# Altium schematic sheet RELAYS.SchDoc
size 420 x 297 mm
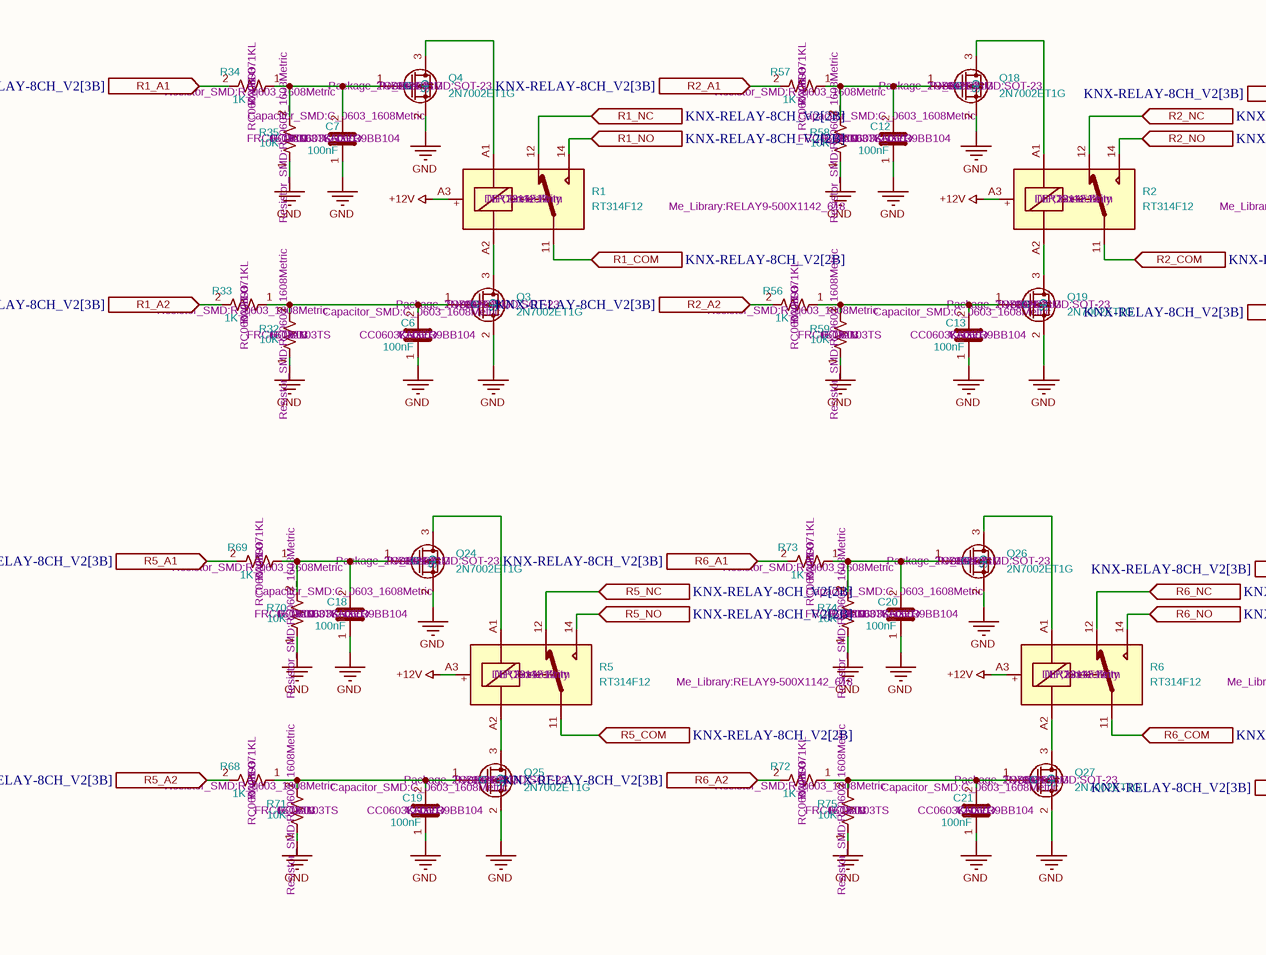
[diagram p0: RELAYS.SchDoc, left]
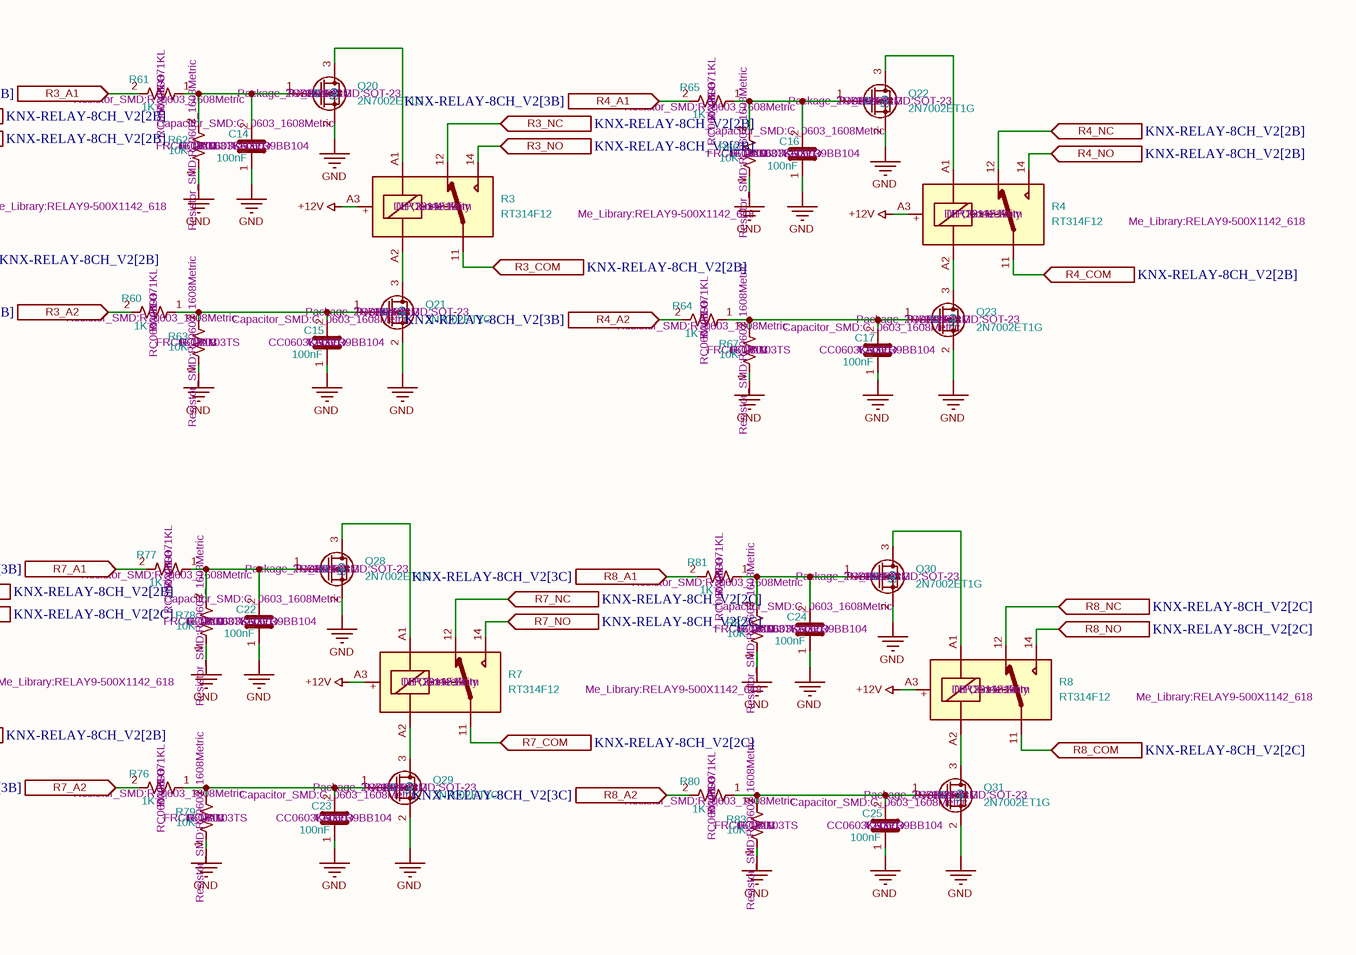
[diagram p1: RELAYS.SchDoc, right]

## Parts
C6  Manufacturer Part Number: CC0603KRX7R9BB104  Manufacturer: YAGEO  Package: C_0603  Footprint: Capacitor_SMD:C_0603_1608Metric  [C_0603_1608Metric]  (hidden comment: 100nF)
C7  Manufacturer Part Number: CC0603KRX7R9BB104  Manufacturer: YAGEO  Package: C_0603  Footprint: Capacitor_SMD:C_0603_1608Metric  [C_0603_1608Metric]  (hidden comment: 100nF)
C12  Manufacturer Part Number: CC0603KRX7R9BB104  Manufacturer: YAGEO  Package: C_0603  Footprint: Capacitor_SMD:C_0603_1608Metric  [C_0603_1608Metric]  (hidden comment: 100nF)
C13  Manufacturer Part Number: CC0603KRX7R9BB104  Manufacturer: YAGEO  Package: C_0603  Footprint: Capacitor_SMD:C_0603_1608Metric  [C_0603_1608Metric]  (hidden comment: 100nF)
C14  Manufacturer Part Number: CC0603KRX7R9BB104  Manufacturer: YAGEO  Package: C_0603  Footprint: Capacitor_SMD:C_0603_1608Metric  [C_0603_1608Metric]  (hidden comment: 100nF)
C15  Manufacturer Part Number: CC0603KRX7R9BB104  Manufacturer: YAGEO  Package: C_0603  Footprint: Capacitor_SMD:C_0603_1608Metric  [C_0603_1608Metric]  (hidden comment: 100nF)
C16  Manufacturer Part Number: CC0603KRX7R9BB104  Manufacturer: YAGEO  Package: C_0603  Footprint: Capacitor_SMD:C_0603_1608Metric  [C_0603_1608Metric]  (hidden comment: 100nF)
C17  Manufacturer Part Number: CC0603KRX7R9BB104  Manufacturer: YAGEO  Package: C_0603  Footprint: Capacitor_SMD:C_0603_1608Metric  [C_0603_1608Metric]  (hidden comment: 100nF)
C18  Manufacturer Part Number: CC0603KRX7R9BB104  Manufacturer: YAGEO  Package: C_0603  Footprint: Capacitor_SMD:C_0603_1608Metric  [C_0603_1608Metric]  (hidden comment: 100nF)
C19  Manufacturer Part Number: CC0603KRX7R9BB104  Manufacturer: YAGEO  Package: C_0603  Footprint: Capacitor_SMD:C_0603_1608Metric  [C_0603_1608Metric]  (hidden comment: 100nF)
C20  Manufacturer Part Number: CC0603KRX7R9BB104  Manufacturer: YAGEO  Package: C_0603  Footprint: Capacitor_SMD:C_0603_1608Metric  [C_0603_1608Metric]  (hidden comment: 100nF)
C21  Manufacturer Part Number: CC0603KRX7R9BB104  Manufacturer: YAGEO  Package: C_0603  Footprint: Capacitor_SMD:C_0603_1608Metric  [C_0603_1608Metric]  (hidden comment: 100nF)
C22  Manufacturer Part Number: CC0603KRX7R9BB104  Manufacturer: YAGEO  Package: C_0603  Footprint: Capacitor_SMD:C_0603_1608Metric  [C_0603_1608Metric]  (hidden comment: 100nF)
C23  Manufacturer Part Number: CC0603KRX7R9BB104  Manufacturer: YAGEO  Package: C_0603  Footprint: Capacitor_SMD:C_0603_1608Metric  [C_0603_1608Metric]  (hidden comment: 100nF)
C24  Manufacturer Part Number: CC0603KRX7R9BB104  Manufacturer: YAGEO  Package: C_0603  Footprint: Capacitor_SMD:C_0603_1608Metric  [C_0603_1608Metric]  (hidden comment: 100nF)
C25  Manufacturer Part Number: CC0603KRX7R9BB104  Manufacturer: YAGEO  Package: C_0603  Footprint: Capacitor_SMD:C_0603_1608Metric  [C_0603_1608Metric]  (hidden comment: 100nF)
Q3  Manufacturer: onsemi  Footprint: Package_TO_SOT_SMD:SOT-23  [SOT-23]  (hidden comment: 2N7002ET1G)
Q4  Manufacturer: onsemi  Footprint: Package_TO_SOT_SMD:SOT-23  [SOT-23]  (hidden comment: 2N7002ET1G)
Q18  Manufacturer: onsemi  Footprint: Package_TO_SOT_SMD:SOT-23  [SOT-23]  (hidden comment: 2N7002ET1G)
Q19  Manufacturer: onsemi  Footprint: Package_TO_SOT_SMD:SOT-23  [SOT-23]  (hidden comment: 2N7002ET1G)
Q20  Manufacturer: onsemi  Footprint: Package_TO_SOT_SMD:SOT-23  [SOT-23]  (hidden comment: 2N7002ET1G)
Q21  Manufacturer: onsemi  Footprint: Package_TO_SOT_SMD:SOT-23  [SOT-23]  (hidden comment: 2N7002ET1G)
Q22  Manufacturer: onsemi  Footprint: Package_TO_SOT_SMD:SOT-23  [SOT-23]  (hidden comment: 2N7002ET1G)
Q23  Manufacturer: onsemi  Footprint: Package_TO_SOT_SMD:SOT-23  [SOT-23]  (hidden comment: 2N7002ET1G)
Q24  Manufacturer: onsemi  Footprint: Package_TO_SOT_SMD:SOT-23  [SOT-23]  (hidden comment: 2N7002ET1G)
Q25  Manufacturer: onsemi  Footprint: Package_TO_SOT_SMD:SOT-23  [SOT-23]  (hidden comment: 2N7002ET1G)
Q26  Manufacturer: onsemi  Footprint: Package_TO_SOT_SMD:SOT-23  [SOT-23]  (hidden comment: 2N7002ET1G)
Q27  Manufacturer: onsemi  Footprint: Package_TO_SOT_SMD:SOT-23  [SOT-23]  (hidden comment: 2N7002ET1G)
Q28  Manufacturer: onsemi  Footprint: Package_TO_SOT_SMD:SOT-23  [SOT-23]  (hidden comment: 2N7002ET1G)
Q29  Manufacturer: onsemi  Footprint: Package_TO_SOT_SMD:SOT-23  [SOT-23]  (hidden comment: 2N7002ET1G)
Q30  Manufacturer: onsemi  Footprint: Package_TO_SOT_SMD:SOT-23  [SOT-23]  (hidden comment: 2N7002ET1G)
Q31  Manufacturer: onsemi  Footprint: Package_TO_SOT_SMD:SOT-23  [SOT-23]  (hidden comment: 2N7002ET1G)
R1  Manufacturer: TE Connectivity  Package: DIP,29x12.7mm  Footprint: Me_Library:RELAY9-500X1142_618  [RELAY9-500X1142_618]  (hidden comment: RT314F12)
R2  Manufacturer: TE Connectivity  Package: DIP,29x12.7mm  Footprint: Me_Library:RELAY9-500X1142_618  [RELAY9-500X1142_618]  (hidden comment: RT314F12)
R3  Manufacturer: TE Connectivity  Package: DIP,29x12.7mm  Footprint: Me_Library:RELAY9-500X1142_618  [RELAY9-500X1142_618]  (hidden comment: RT314F12)
R4  Manufacturer: TE Connectivity  Package: DIP,29x12.7mm  Footprint: Me_Library:RELAY9-500X1142_618  [RELAY9-500X1142_618]  (hidden comment: RT314F12)
R5  Manufacturer: TE Connectivity  Package: DIP,29x12.7mm  Footprint: Me_Library:RELAY9-500X1142_618  [RELAY9-500X1142_618]  (hidden comment: RT314F12)
R6  Manufacturer: TE Connectivity  Package: DIP,29x12.7mm  Footprint: Me_Library:RELAY9-500X1142_618  [RELAY9-500X1142_618]  (hidden comment: RT314F12)
R7  Manufacturer: TE Connectivity  Package: DIP,29x12.7mm  Footprint: Me_Library:RELAY9-500X1142_618  [RELAY9-500X1142_618]  (hidden comment: RT314F12)
R8  Manufacturer: TE Connectivity  Package: DIP,29x12.7mm  Footprint: Me_Library:RELAY9-500X1142_618  [RELAY9-500X1142_618]  (hidden comment: RT314F12)
R32  Manufacturer Part Number: FRC0603J103TS  Manufacturer: FOJAN  Package: R_0603  Footprint: Resistor_SMD:R_0603_1608Metric  [R_0603_1608Metric]  (hidden comment: 10K)
R33  Manufacturer Part Number: RC0603JR-071KL  Manufacturer: YAGEO  Package: R_0603  Footprint: Resistor_SMD:R_0603_1608Metric  [R_0603_1608Metric]  (hidden comment: 1K)
R34  Manufacturer Part Number: RC0603JR-071KL  Manufacturer: YAGEO  Package: R_0603  Footprint: Resistor_SMD:R_0603_1608Metric  [R_0603_1608Metric]  (hidden comment: 1K)
R35  Manufacturer Part Number: FRC0603J103TS  Manufacturer: FOJAN  Package: R_0603  Footprint: Resistor_SMD:R_0603_1608Metric  [R_0603_1608Metric]  (hidden comment: 10K)
R56  Manufacturer Part Number: RC0603JR-071KL  Manufacturer: YAGEO  Package: R_0603  Footprint: Resistor_SMD:R_0603_1608Metric  [R_0603_1608Metric]  (hidden comment: 1K)
R57  Manufacturer Part Number: RC0603JR-071KL  Manufacturer: YAGEO  Package: R_0603  Footprint: Resistor_SMD:R_0603_1608Metric  [R_0603_1608Metric]  (hidden comment: 1K)
R58  Manufacturer Part Number: FRC0603J103TS  Manufacturer: FOJAN  Package: R_0603  Footprint: Resistor_SMD:R_0603_1608Metric  [R_0603_1608Metric]  (hidden comment: 10K)
R59  Manufacturer Part Number: FRC0603J103TS  Manufacturer: FOJAN  Package: R_0603  Footprint: Resistor_SMD:R_0603_1608Metric  [R_0603_1608Metric]  (hidden comment: 10K)
R60  Manufacturer Part Number: RC0603JR-071KL  Manufacturer: YAGEO  Package: R_0603  Footprint: Resistor_SMD:R_0603_1608Metric  [R_0603_1608Metric]  (hidden comment: 1K)
R61  Manufacturer Part Number: RC0603JR-071KL  Manufacturer: YAGEO  Package: R_0603  Footprint: Resistor_SMD:R_0603_1608Metric  [R_0603_1608Metric]  (hidden comment: 1K)
R62  Manufacturer Part Number: FRC0603J103TS  Manufacturer: FOJAN  Package: R_0603  Footprint: Resistor_SMD:R_0603_1608Metric  [R_0603_1608Metric]  (hidden comment: 10K)
R63  Manufacturer Part Number: FRC0603J103TS  Manufacturer: FOJAN  Package: R_0603  Footprint: Resistor_SMD:R_0603_1608Metric  [R_0603_1608Metric]  (hidden comment: 10K)
R64  Manufacturer Part Number: RC0603JR-071KL  Manufacturer: YAGEO  Package: R_0603  Footprint: Resistor_SMD:R_0603_1608Metric  [R_0603_1608Metric]  (hidden comment: 1K)
R65  Manufacturer Part Number: RC0603JR-071KL  Manufacturer: YAGEO  Package: R_0603  Footprint: Resistor_SMD:R_0603_1608Metric  [R_0603_1608Metric]  (hidden comment: 1K)
R66  Manufacturer Part Number: FRC0603J103TS  Manufacturer: FOJAN  Package: R_0603  Footprint: Resistor_SMD:R_0603_1608Metric  [R_0603_1608Metric]  (hidden comment: 10K)
R67  Manufacturer Part Number: FRC0603J103TS  Manufacturer: FOJAN  Package: R_0603  Footprint: Resistor_SMD:R_0603_1608Metric  [R_0603_1608Metric]  (hidden comment: 10K)
R68  Manufacturer Part Number: RC0603JR-071KL  Manufacturer: YAGEO  Package: R_0603  Footprint: Resistor_SMD:R_0603_1608Metric  [R_0603_1608Metric]  (hidden comment: 1K)
R69  Manufacturer Part Number: RC0603JR-071KL  Manufacturer: YAGEO  Package: R_0603  Footprint: Resistor_SMD:R_0603_1608Metric  [R_0603_1608Metric]  (hidden comment: 1K)
R70  Manufacturer Part Number: FRC0603J103TS  Manufacturer: FOJAN  Package: R_0603  Footprint: Resistor_SMD:R_0603_1608Metric  [R_0603_1608Metric]  (hidden comment: 10K)
R71  Manufacturer Part Number: FRC0603J103TS  Manufacturer: FOJAN  Package: R_0603  Footprint: Resistor_SMD:R_0603_1608Metric  [R_0603_1608Metric]  (hidden comment: 10K)
R72  Manufacturer Part Number: RC0603JR-071KL  Manufacturer: YAGEO  Package: R_0603  Footprint: Resistor_SMD:R_0603_1608Metric  [R_0603_1608Metric]  (hidden comment: 1K)
R73  Manufacturer Part Number: RC0603JR-071KL  Manufacturer: YAGEO  Package: R_0603  Footprint: Resistor_SMD:R_0603_1608Metric  [R_0603_1608Metric]  (hidden comment: 1K)
R74  Manufacturer Part Number: FRC0603J103TS  Manufacturer: FOJAN  Package: R_0603  Footprint: Resistor_SMD:R_0603_1608Metric  [R_0603_1608Metric]  (hidden comment: 10K)
R75  Manufacturer Part Number: FRC0603J103TS  Manufacturer: FOJAN  Package: R_0603  Footprint: Resistor_SMD:R_0603_1608Metric  [R_0603_1608Metric]  (hidden comment: 10K)
R76  Manufacturer Part Number: RC0603JR-071KL  Manufacturer: YAGEO  Package: R_0603  Footprint: Resistor_SMD:R_0603_1608Metric  [R_0603_1608Metric]  (hidden comment: 1K)
R77  Manufacturer Part Number: RC0603JR-071KL  Manufacturer: YAGEO  Package: R_0603  Footprint: Resistor_SMD:R_0603_1608Metric  [R_0603_1608Metric]  (hidden comment: 1K)
R78  Manufacturer Part Number: FRC0603J103TS  Manufacturer: FOJAN  Package: R_0603  Footprint: Resistor_SMD:R_0603_1608Metric  [R_0603_1608Metric]  (hidden comment: 10K)
R79  Manufacturer Part Number: FRC0603J103TS  Manufacturer: FOJAN  Package: R_0603  Footprint: Resistor_SMD:R_0603_1608Metric  [R_0603_1608Metric]  (hidden comment: 10K)
R80  Manufacturer Part Number: RC0603JR-071KL  Manufacturer: YAGEO  Package: R_0603  Footprint: Resistor_SMD:R_0603_1608Metric  [R_0603_1608Metric]  (hidden comment: 1K)
R81  Manufacturer Part Number: RC0603JR-071KL  Manufacturer: YAGEO  Package: R_0603  Footprint: Resistor_SMD:R_0603_1608Metric  [R_0603_1608Metric]  (hidden comment: 1K)
R82  Manufacturer Part Number: FRC0603J103TS  Manufacturer: FOJAN  Package: R_0603  Footprint: Resistor_SMD:R_0603_1608Metric  [R_0603_1608Metric]  (hidden comment: 10K)
R83  Manufacturer Part Number: FRC0603J103TS  Manufacturer: FOJAN  Package: R_0603  Footprint: Resistor_SMD:R_0603_1608Metric  [R_0603_1608Metric]  (hidden comment: 10K)

## Ports
R1_A1 (in, see KNX-RELAY-8CH_V2[3B]), R1_A2 (in, see KNX-RELAY-8CH_V2[3B]), R1_COM (in, see KNX-RELAY-8CH_V2[2B]), R1_NC (in, see KNX-RELAY-8CH_V2[2B]), R1_NO (in, see KNX-RELAY-8CH_V2[2B]), R2_A1 (in, see KNX-RELAY-8CH_V2[3B]), R2_A2 (in, see KNX-RELAY-8CH_V2[3B]), R2_COM (in, see KNX-RELAY-8CH_V2[2B]), R2_NC (in, see KNX-RELAY-8CH_V2[2B]), R2_NO (in, see KNX-RELAY-8CH_V2[2B]), R3_A1 (in, see KNX-RELAY-8CH_V2[3B]), R3_A2 (in, see KNX-RELAY-8CH_V2[3B]), R3_COM (in, see KNX-RELAY-8CH_V2[2B]), R3_NC (in, see KNX-RELAY-8CH_V2[2B]), R3_NO (in, see KNX-RELAY-8CH_V2[2B]), R4_A1 (in, see KNX-RELAY-8CH_V2[3B]), R4_A2 (in, see KNX-RELAY-8CH_V2[3B]), R4_COM (in, see KNX-RELAY-8CH_V2[2B]), R4_NC (in, see KNX-RELAY-8CH_V2[2B]), R4_NO (in, see KNX-RELAY-8CH_V2[2B]), R5_A1 (in, see KNX-RELAY-8CH_V2[3B]), R5_A2 (in, see KNX-RELAY-8CH_V2[3B]), R5_COM (in, see KNX-RELAY-8CH_V2[2B]), R5_NC (in, see KNX-RELAY-8CH_V2[2B]), R5_NO (in, see KNX-RELAY-8CH_V2[2B]), R6_A1 (in, see KNX-RELAY-8CH_V2[3B]), R6_A2 (in, see KNX-RELAY-8CH_V2[3B]), R6_COM (in, see KNX-RELAY-8CH_V2[2B]), R6_NC (in, see KNX-RELAY-8CH_V2[2B]), R6_NO (in, see KNX-RELAY-8CH_V2[2C]), R7_A1 (in, see KNX-RELAY-8CH_V2[3B]), R7_A2 (in, see KNX-RELAY-8CH_V2[3B]), R7_COM (in, see KNX-RELAY-8CH_V2[2C]), R7_NC (in, see KNX-RELAY-8CH_V2[2C]), R7_NO (in, see KNX-RELAY-8CH_V2[2C]), R8_A1 (in, see KNX-RELAY-8CH_V2[3C]), R8_A2 (in, see KNX-RELAY-8CH_V2[3C]), R8_COM (in, see KNX-RELAY-8CH_V2[2C]), R8_NC (in, see KNX-RELAY-8CH_V2[2C]), R8_NO (in, see KNX-RELAY-8CH_V2[2C])

## Nets
+12V: R1.A3 R2.A3 R3.A3 R4.A3 R5.A3 R6.A3 R7.A3 R8.A3
GND: C6.1 C7.1 C12.1 C13.1 C14.1 C15.1 C16.1 C17.1 C18.1 C19.1 C20.1 C21.1 C22.1 C23.1 C24.1 C25.1 Q3.2(S) Q4.2(S) Q18.2(S) Q19.2(S) Q20.2(S) Q21.2(S) Q22.2(S) Q23.2(S) Q24.2(S) Q25.2(S) Q26.2(S) Q27.2(S) Q28.2(S) Q29.2(S) Q30.2(S) Q31.2(S) R32.1 R35.1 R58.1 R59.1 R62.1 R63.1 R66.1 R67.1 R70.1 R71.1 R74.1 R75.1 R78.1 R79.1 R82.1 R83.1
R1_A1: R34.2 ; port R1_A1
R1_A2: R33.2 ; port R1_A2
R1_COM: R1.11 ; port R1_COM
R1_NC: R1.12 ; port R1_NC
R1_NO: R1.14 ; port R1_NO
R2_A1: R57.2 ; port R2_A1
R2_A2: R56.2 ; port R2_A2
R2_COM: R2.11 ; port R2_COM
R2_NC: R2.12 ; port R2_NC
R2_NO: R2.14 ; port R2_NO
R3_A1: R61.2 ; port R3_A1
R3_A2: R60.2 ; port R3_A2
R3_COM: R3.11 ; port R3_COM
R3_NC: R3.12 ; port R3_NC
R3_NO: R3.14 ; port R3_NO
R4_A1: R65.2 ; port R4_A1
R4_A2: R64.2 ; port R4_A2
R4_COM: R4.11 ; port R4_COM
R4_NC: R4.12 ; port R4_NC
R4_NO: R4.14 ; port R4_NO
R5_A1: R69.2 ; port R5_A1
R5_A2: R68.2 ; port R5_A2
R5_COM: R5.11 ; port R5_COM
R5_NC: R5.12 ; port R5_NC
R5_NO: R5.14 ; port R5_NO
R6_A1: R73.2 ; port R6_A1
R6_A2: R72.2 ; port R6_A2
R6_COM: R6.11 ; port R6_COM
R6_NC: R6.12 ; port R6_NC
R6_NO: R6.14 ; port R6_NO
R7_A1: R77.2 ; port R7_A1
R7_A2: R76.2 ; port R7_A2
R7_COM: R7.11 ; port R7_COM
R7_NC: R7.12 ; port R7_NC
R7_NO: R7.14 ; port R7_NO
R8_A1: R81.2 ; port R8_A1
R8_A2: R80.2 ; port R8_A2
R8_COM: R8.11 ; port R8_COM
R8_NC: R8.12 ; port R8_NC
R8_NO: R8.14 ; port R8_NO
NetC6_2: C6.2 Q3.1(G) R32.2 R33.1
NetC7_2: C7.2 Q4.1(G) R34.1 R35.2
NetC12_2: C12.2 Q18.1(G) R57.1 R58.2
NetC13_2: C13.2 Q19.1(G) R56.1 R59.2
NetC14_2: C14.2 Q20.1(G) R61.1 R62.2
NetC15_2: C15.2 Q21.1(G) R60.1 R63.2
NetC16_2: C16.2 Q22.1(G) R65.1 R66.2
NetC17_2: C17.2 Q23.1(G) R64.1 R67.2
NetC18_2: C18.2 Q24.1(G) R69.1 R70.2
NetC19_2: C19.2 Q25.1(G) R68.1 R71.2
NetC20_2: C20.2 Q26.1(G) R73.1 R74.2
NetC21_2: C21.2 Q27.1(G) R72.1 R75.2
NetC22_2: C22.2 Q28.1(G) R77.1 R78.2
NetC23_2: C23.2 Q29.1(G) R76.1 R79.2
NetC24_2: C24.2 Q30.1(G) R81.1 R82.2
NetC25_2: C25.2 Q31.1(G) R80.1 R83.2
NetQ3_3: Q3.3(D) R1.A2
NetQ4_3: Q4.3(D) R1.A1
NetQ18_3: Q18.3(D) R2.A1
NetQ19_3: Q19.3(D) R2.A2
NetQ20_3: Q20.3(D) R3.A1
NetQ21_3: Q21.3(D) R3.A2
NetQ22_3: Q22.3(D) R4.A1
NetQ23_3: Q23.3(D) R4.A2
NetQ24_3: Q24.3(D) R5.A1
NetQ25_3: Q25.3(D) R5.A2
NetQ26_3: Q26.3(D) R6.A1
NetQ27_3: Q27.3(D) R6.A2
NetQ28_3: Q28.3(D) R7.A1
NetQ29_3: Q29.3(D) R7.A2
NetQ30_3: Q30.3(D) R8.A1
NetQ31_3: Q31.3(D) R8.A2

## Notes on the sheet
- 1
- 2
- 3
- 4
- 5
- 6
- 7
- 8
- A
- B
- C
- D
- E
- Title:
- File: RELAYS.kicad_sch
- Sheet: /
- F
- KiCad E.D.A.  kicad (5.1.4)-1
- Size: A3
- Date:
- Rev:
- Id: 1/1
- (in symbol RT314A03) +

## Library data of the parts
C6 C7 C12-C25 = C_3: Value: 100nF
Q3 Q4 Q18-Q31 = Q_NMOS_Depletion_GSD: Manufacturer Part Number: 2N7002ET1G; Package: SOT-23; Value: 2N7002ET1G
R1-R8 = RT314A03: Manufacturer Part Number: RT314F12; Value: RT314F12
R32-R35 R56-R83 = R_US
  R32 R35 R58 R59 R62 R63 R66 R67 R70 R71 R74 R75 R78 R79 R82 R83: Value: 10K
  R33 R34 R56 R57 R60 R61 R64 R65 R68 R69 R72 R73 R76 R77 R80 R81: Value: 1K